# Altium project Face_Ant1V0.PrjPCB
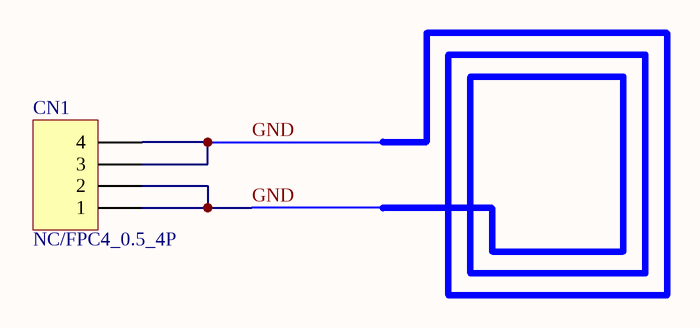
[diagram p0: Face_Ant1V0.SchDoc]
1 sheet, 1 parts. Net scope: global (net labels, ports and power ports of the same name join across sheets).
Board file: Face_Ant1V0.PcbDoc

## Sheet Face_Ant1V0.SchDoc: Ant_1V0
size A4

### Parts
CN1  NC/FPC4_0.5_4P  [FFC0.5MM-4P]

### Nets
GND: CN1.1 CN1.2 CN1.3 CN1.4

### Library data of the parts
CN1 = Header 1: FPC4_0.5_4P; LatestRevisionDate: 17-Jul-2002; LatestRevisionNote: Re-released for DXP Platform.; Publisher: Altium Limited